# Altium schematic sheet PROC054D_AWR_Interfaces.SchDoc: AWR_1
size 558 x 431 mm; Date: Not shown in title block; ApprovedBy: Not shown in title block; CheckedBy: Not shown in title block; Author: Not shown in title block; CompanyName: Not shown in title block; DrawnBy: a0271760; Engineer: Not shown in title block; Organization: Not shown in title block; Address1: Not shown in title block; Address2: Not shown in title block; Address3: Not shown in title block; Address4: Not shown in title block; DocumentNumber: 10; Revision: Use project pAWRameter SCH_Rev; SheetNumber: 10; SheetTotal: 19; PageSetup: Record=PageOptions|CenterHorizontal=True|CenterVertical=True|PrintScale=1.00|XCorrection=1.00|YCorrection=1.00|PrintKind=0|BorderSize=5000000|LeftOffset=0|BottomOffset=0|Orientation=2|PaperLength=1000|PaperWidth=1000|Scale=100|PaperSource=15|PrintQuality=600|MediaType=1|DitherType=10|PaperKind=Letter|PrintScaleMode=1; CurrentTime: Not shown in title block; CurrentDate: Not shown in title block; Time: Not shown in title block; DocumentFullPathAndName: Not shown in title block; DocumentName: Not shown in title block; ModifiedDate: Not shown in title block; ImagePath: Not shown in title block
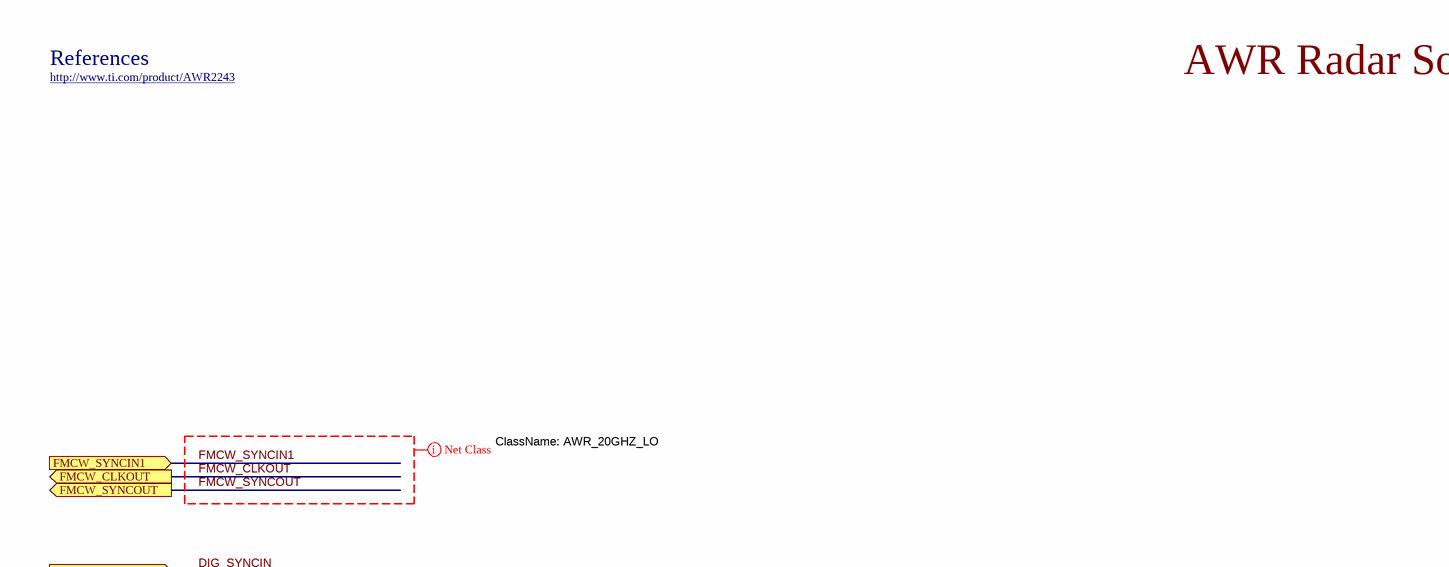
[diagram p0: PROC054D_AWR_Interfaces.SchDoc, top left]
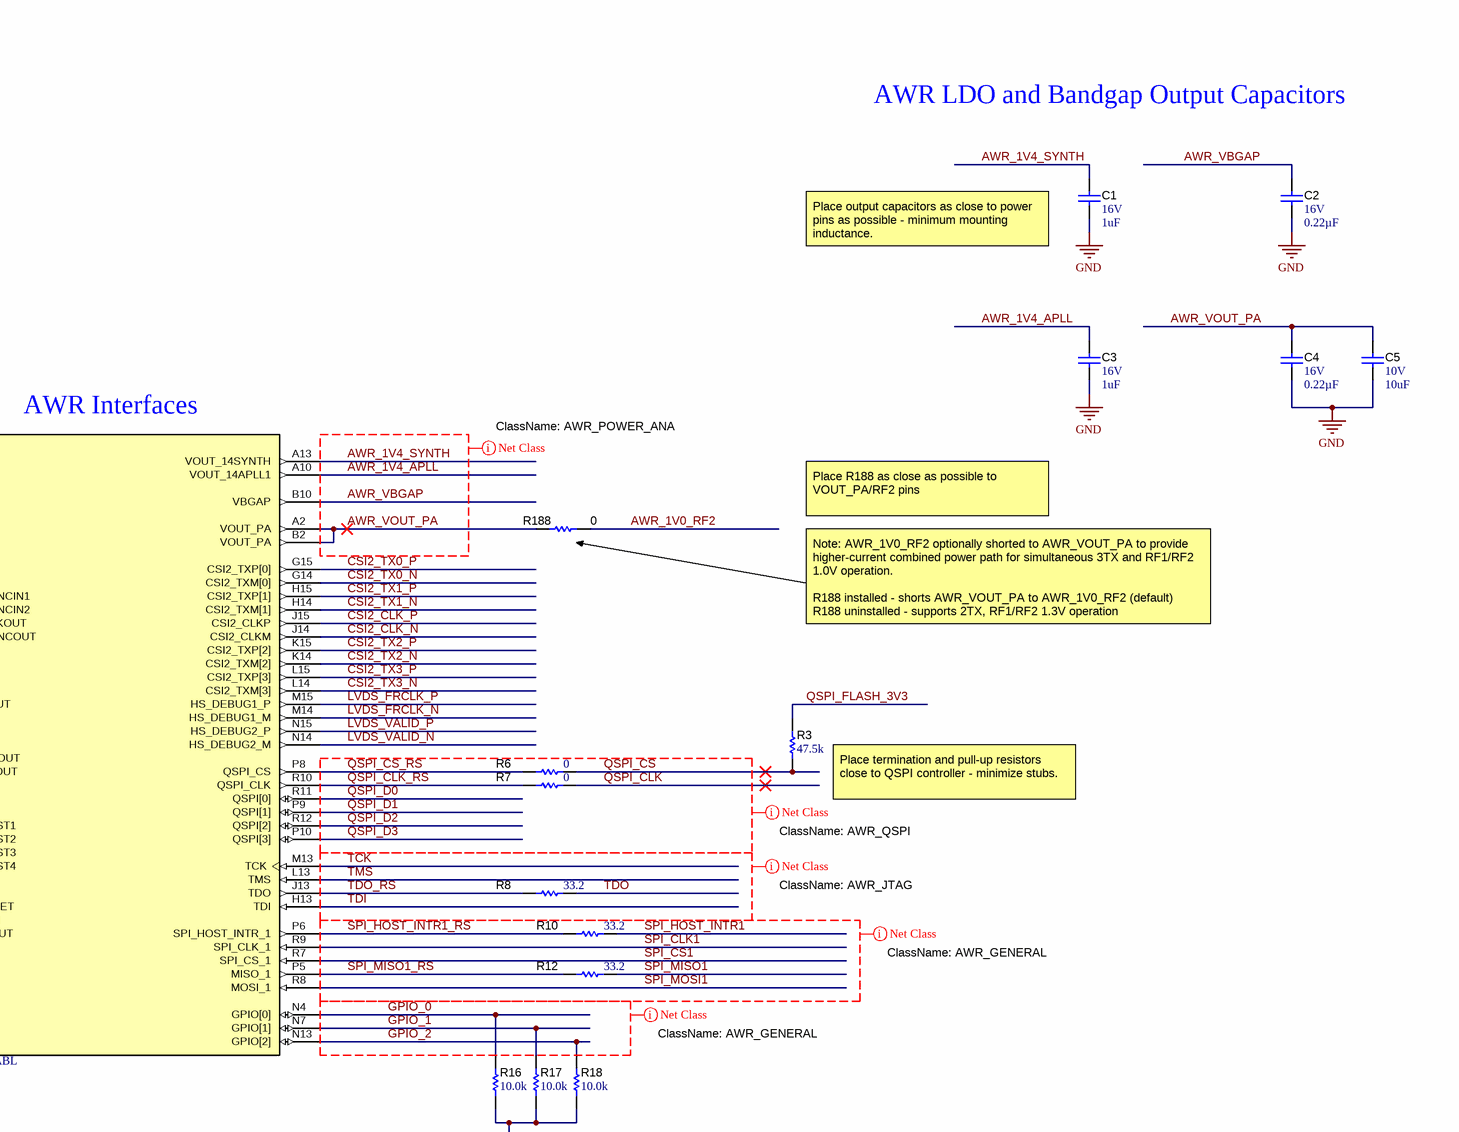
[diagram p1: PROC054D_AWR_Interfaces.SchDoc, top right]
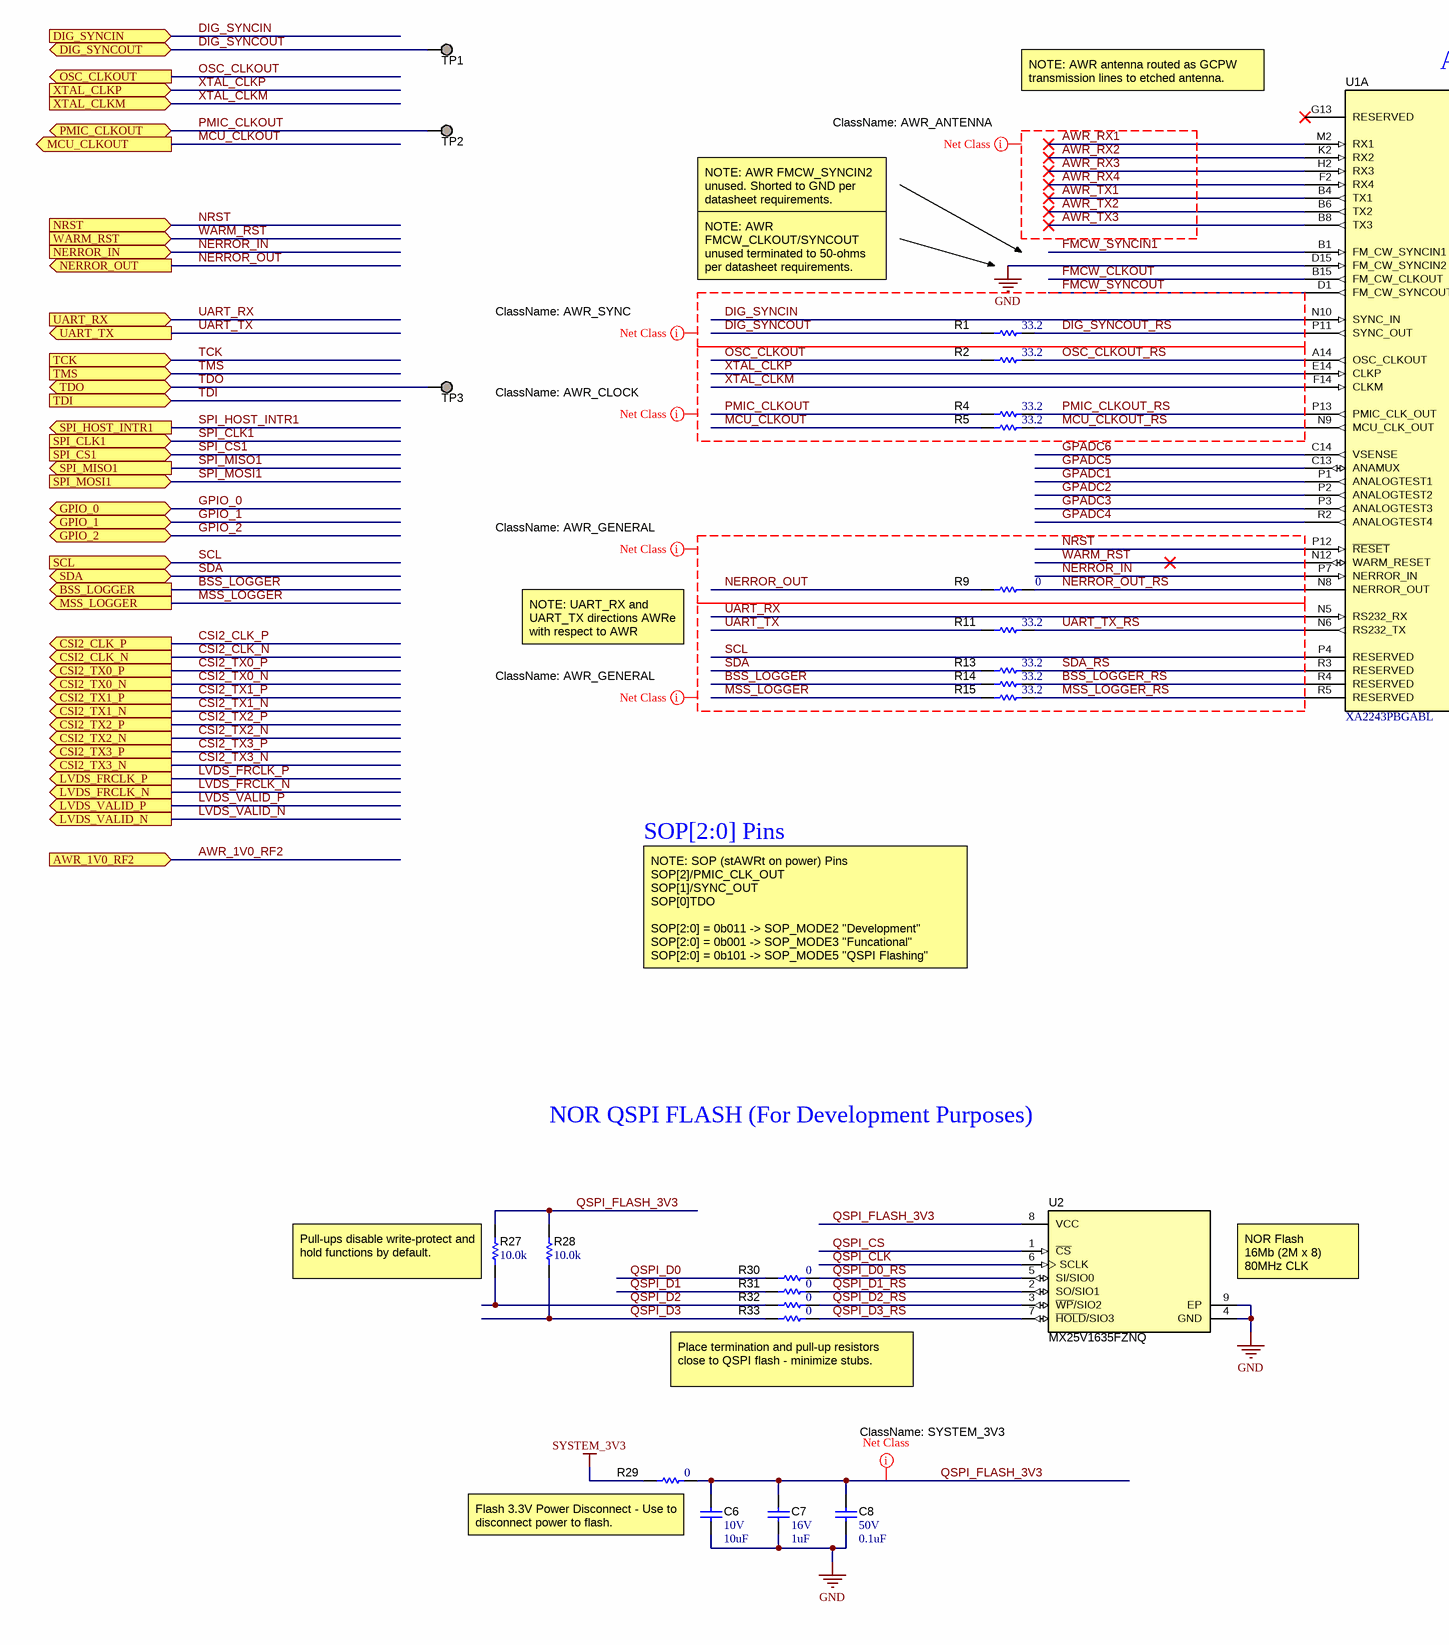
[diagram p2: PROC054D_AWR_Interfaces.SchDoc, bottom left]
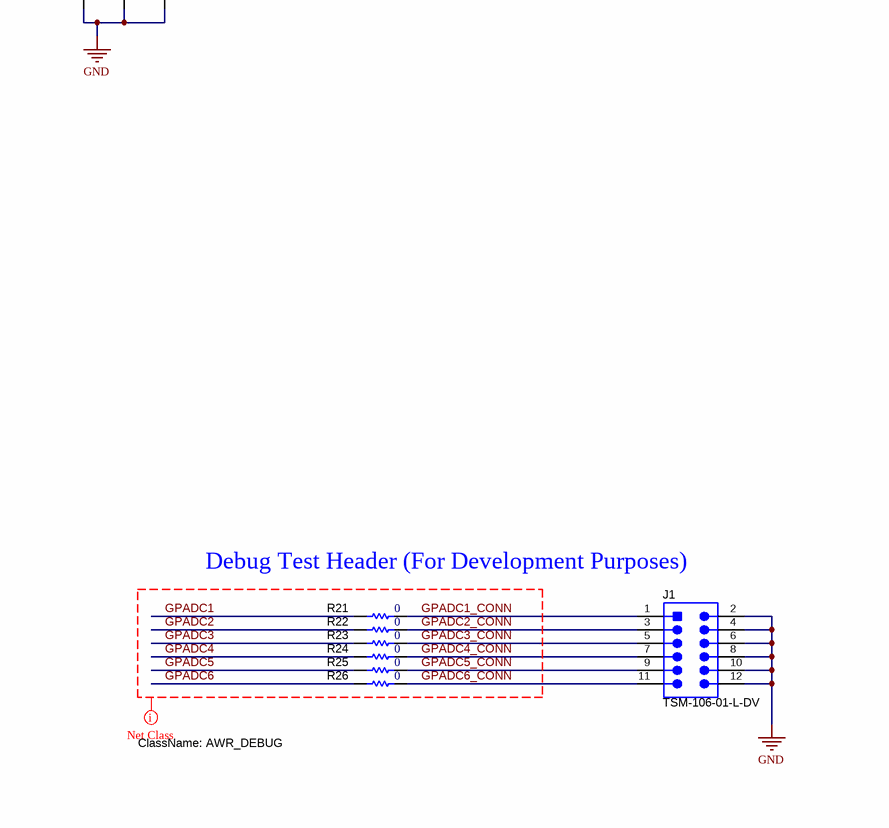
[diagram p3: PROC054D_AWR_Interfaces.SchDoc, bottom right]

## Parts
C1  VDC_V: 16V  ValueDisplayed: 1uF  [0603S]  (hidden comment: GCM188R71C105KA64D)
C2  VDC_V: 16V  ValueDisplayed: 0.22µF  [0402S]  (hidden comment: GCM155R71C224KE02D)
C3  VDC_V: 16V  ValueDisplayed: 1uF  [0603S]  (hidden comment: GCM188R71C105KA64D)
C4  VDC_V: 16V  ValueDisplayed: 0.22µF  [0402]  (hidden comment: GCM155R71C224KE02D)
C5  VDC_V: 10V  ValueDisplayed: 10uF  [0805]  (hidden comment: GCM21BR71A106KE22L)
C6  VDC_V: 10V  ValueDisplayed: 10uF  [0805L]  (hidden comment: GCM21BR71A106KE22L)
C7  VDC_V: 16V  ValueDisplayed: 1uF  [0603S]  (hidden comment: GCM188R71C105KA64D)
C8  VDC_V: 50V  ValueDisplayed: 0.1uF  [0402S]  (hidden comment: CGA2B3X7R1H104K050BB)
J1  TSM-106-01-L-DV  [Samtec_TSM-106-01-x-DV]
R1  ValueDisplayed: 33.2  [0402S]  (hidden comment: CRCW040233R2FKED)
R2  ValueDisplayed: 33.2  [0402S]  (hidden comment: CRCW040233R2FKED)
R3  ValueDisplayed: 47.5k  [0402]  (hidden comment: CRCW040247K5FKED)
R4  ValueDisplayed: 33.2  [0402S]  (hidden comment: CRCW040233R2FKED)
R5  ValueDisplayed: 33.2  [0402S]  (hidden comment: CRCW040233R2FKED)
R6  ValueDisplayed: 0  [0201]  (hidden comment: CRCW02010000Z0ED)
R7  ValueDisplayed: 0  [0201]  (hidden comment: CRCW02010000Z0ED)
R8  ValueDisplayed: 33.2  [0402S]  (hidden comment: CRCW040233R2FKED)
R9  ValueDisplayed: 0  [0402S]  (hidden comment: ERJ-2GE0R00X)
R10  ValueDisplayed: 33.2  [0402S]  (hidden comment: CRCW040233R2FKED)
R11  ValueDisplayed: 33.2  [0402S]  (hidden comment: CRCW040233R2FKED)
R12  ValueDisplayed: 33.2  [0402S]  (hidden comment: CRCW040233R2FKED)
R13  ValueDisplayed: 33.2  [0402S]  (hidden comment: CRCW040233R2FKED)
R14  ValueDisplayed: 33.2  [0402S]  (hidden comment: CRCW040233R2FKED)
R15  ValueDisplayed: 33.2  [0402S]  (hidden comment: CRCW040233R2FKED)
R16  ValueDisplayed: 10.0k  [0402]  (hidden comment: CRCW040210K0FKED)
R17  ValueDisplayed: 10.0k  [0402]  (hidden comment: CRCW040210K0FKED)
R18  ValueDisplayed: 10.0k  [0402]  (hidden comment: CRCW040210K0FKED)
R21  ValueDisplayed: 0  [0402]  (hidden comment: CRCW04020000Z0ED)
R22  ValueDisplayed: 0  [0402]  (hidden comment: CRCW04020000Z0ED)
R23  ValueDisplayed: 0  [0402]  (hidden comment: CRCW04020000Z0ED)
R24  ValueDisplayed: 0  [0402]  (hidden comment: CRCW04020000Z0ED)
R25  ValueDisplayed: 0  [0402]  (hidden comment: CRCW04020000Z0ED)
R26  ValueDisplayed: 0  [0402]  (hidden comment: CRCW04020000Z0ED)
R27  ValueDisplayed: 10.0k  [0402S]  (hidden comment: CRCW040210K0FKED)
R28  ValueDisplayed: 10.0k  [0402S]  (hidden comment: CRCW040210K0FKED)
R29  ValueDisplayed: 0  [0805_HV]  (hidden comment: CRCW08050000Z0EAHP)
R30  ValueDisplayed: 0  [0201]  (hidden comment: CRCW02010000Z0ED)
R31  ValueDisplayed: 0  [0201]  (hidden comment: CRCW02010000Z0ED)
R32  ValueDisplayed: 0  [0201]  (hidden comment: CRCW02010000Z0ED)
R33  ValueDisplayed: 0  [0201]  (hidden comment: CRCW02010000Z0ED)
R188  ValueDisplayed: 0  [0805L]  (hidden comment: PMR10EZPJ000)
TP1  TP_SM_1MM  [TP_SM_1MM]  (value not drawn)  (no BOM)
TP2  TP_SM_1MM  [TP_SM_1MM]  (value not drawn)  (no BOM)
TP3  TP_SM_1MM  [TP_SM_1MM]  (value not drawn)  (no BOM)
U1  XA2243PBGABL  [ABL0161A]  (part A of 2)
U2  MX25V1635FZNQ  [WSON-8L_6x5MM_EP]

## Ports
AWR_1V0_RF2 (in), BSS_LOGGER (out), CSI2_CLK_N (out), CSI2_CLK_P (out), CSI2_TX0_N (out), CSI2_TX0_P (out), CSI2_TX1_N (out), CSI2_TX1_P (out), CSI2_TX2_N (out), CSI2_TX2_P (out), CSI2_TX3_N (out), CSI2_TX3_P (out), DIG_SYNCIN (in), DIG_SYNCOUT (bidir), FMCW_CLKOUT (out), FMCW_SYNCIN1 (in), FMCW_SYNCOUT (out), GPIO_0 (bidir), GPIO_1 (bidir), GPIO_2 (bidir), LVDS_FRCLK_N (out), LVDS_FRCLK_P (out), LVDS_VALID_N (out), LVDS_VALID_P (out), MCU_CLKOUT (out), MSS_LOGGER (out), NERROR_IN (in), NERROR_OUT (out), NRST (in), OSC_CLKOUT (out), PMIC_CLKOUT (bidir), SCL (in), SDA (bidir), SPI_CLK1 (in), SPI_CS1 (in), SPI_HOST_INTR1 (out), SPI_MISO1 (out), SPI_MOSI1 (in), TCK (in), TDI (in), TDO (bidir), TMS (in), UART_RX (in), UART_TX (out), WARM_RST (in), XTAL_CLKM (in), XTAL_CLKP (in)

## Nets
GND: C1.2 C2.2 C3.2 C4.2 C5.2 C6.2 C7.2 C8.2 J1.2 J1.4 J1.6 J1.8 J1.10 J1.12 R16.1 R17.1 R18.1 U1.D15(FM_CW_SYNCIN2) U2.4(GND) U2.9(EP)
SYSTEM_3V3: R29.2
AWR_1V0_RF2: R188.2 ; port AWR_1V0_RF2
AWR_1V4_APLL: C3.1 U1.A10(VOUT_14APLL1)
AWR_1V4_SYNTH: C1.1 U1.A13(VOUT_14SYNTH)
AWR_RX1: U1.M2(RX1)
AWR_RX2: U1.K2(RX2)
AWR_RX3: U1.H2(RX3)
AWR_RX4: U1.F2(RX4)
AWR_TX1: U1.B4(TX1)
AWR_TX2: U1.B6(TX2)
AWR_TX3: U1.B8(TX3)
AWR_VBGAP: C2.1 U1.B10(VBGAP)
AWR_VOUT_PA: C4.1 C5.1 R188.1 U1.A2(VOUT_PA) U1.B2(VOUT_PA)
BSS_LOGGER: R14.1 ; port BSS_LOGGER
BSS_LOGGER_RS: R14.2 U1.R4(RESERVED)
CSI2_CLK_N: U1.J14(CSI2_CLKM) ; port CSI2_CLK_N
CSI2_CLK_P: U1.J15(CSI2_CLKP) ; port CSI2_CLK_P
CSI2_TX0_N: U1.G14(CSI2_TXM[0]) ; port CSI2_TX0_N
CSI2_TX0_P: U1.G15(CSI2_TXP[0]) ; port CSI2_TX0_P
CSI2_TX1_N: U1.H14(CSI2_TXM[1]) ; port CSI2_TX1_N
CSI2_TX1_P: U1.H15(CSI2_TXP[1]) ; port CSI2_TX1_P
CSI2_TX2_N: U1.K14(CSI2_TXM[2]) ; port CSI2_TX2_N
CSI2_TX2_P: U1.K15(CSI2_TXP[2]) ; port CSI2_TX2_P
CSI2_TX3_N: U1.L14(CSI2_TXM[3]) ; port CSI2_TX3_N
CSI2_TX3_P: U1.L15(CSI2_TXP[3]) ; port CSI2_TX3_P
DIG_SYNCIN: U1.N10(SYNC_IN) ; port DIG_SYNCIN
DIG_SYNCOUT: R1.1 TP1.1 ; port DIG_SYNCOUT
DIG_SYNCOUT_RS: R1.2 U1.P11(SYNC_OUT)
FMCW_CLKOUT: U1.B15(FM_CW_CLKOUT) ; port FMCW_CLKOUT
FMCW_SYNCIN1: U1.B1(FM_CW_SYNCIN1) ; port FMCW_SYNCIN1
FMCW_SYNCOUT: U1.D1(FM_CW_SYNCOUT) ; port FMCW_SYNCOUT
GPADC1: R21.1 U1.P1(ANALOGTEST1)
GPADC1_CONN: J1.1 R21.2
GPADC2: R22.1 U1.P2(ANALOGTEST2)
GPADC2_CONN: J1.3 R22.2
GPADC3: R23.1 U1.P3(ANALOGTEST3)
GPADC3_CONN: J1.5 R23.2
GPADC4: R24.1 U1.R2(ANALOGTEST4)
GPADC4_CONN: J1.7 R24.2
GPADC5: R25.1 U1.C13(ANAMUX)
GPADC5_CONN: J1.9 R25.2
GPADC6: R26.1 U1.C14(VSENSE)
GPADC6_CONN: J1.11 R26.2
GPIO_0: R16.2 U1.N4(GPIO[0]) ; port GPIO_0
GPIO_1: R17.2 U1.N7(GPIO[1]) ; port GPIO_1
GPIO_2: R18.2 U1.N13(GPIO[2]) ; port GPIO_2
LVDS_FRCLK_N: U1.M14(HS_DEBUG1_M) ; port LVDS_FRCLK_N
LVDS_FRCLK_P: U1.M15(HS_DEBUG1_P) ; port LVDS_FRCLK_P
LVDS_VALID_N: U1.N14(HS_DEBUG2_M) ; port LVDS_VALID_N
LVDS_VALID_P: U1.N15(HS_DEBUG2_P) ; port LVDS_VALID_P
MCU_CLKOUT: R5.1 ; port MCU_CLKOUT
MCU_CLKOUT_RS: R5.2 U1.N9(MCU_CLK_OUT)
MSS_LOGGER: R15.1 ; port MSS_LOGGER
MSS_LOGGER_RS: R15.2 U1.R5(RESERVED)
NERROR_IN: U1.P7(NERROR_IN) ; port NERROR_IN
NERROR_OUT: R9.1 ; port NERROR_OUT
NERROR_OUT_RS: R9.2 U1.N8(NERROR_OUT)
NRST: U1.P12(~{RESET}) ; port NRST
OSC_CLKOUT: R2.1 ; port OSC_CLKOUT
OSC_CLKOUT_RS: R2.2 U1.A14(OSC_CLKOUT)
PMIC_CLKOUT: R4.1 TP2.1 ; port PMIC_CLKOUT
PMIC_CLKOUT_RS: R4.2 U1.P13(PMIC_CLK_OUT)
QSPI_CLK: R7.2 U2.6(SCLK)
QSPI_CLK_RS: R7.1 U1.R10(QSPI_CLK)
QSPI_CS: R3.1 R6.2 U2.1(~{CS})
QSPI_CS_RS: R6.1 U1.P8(QSPI_CS)
QSPI_D0: R30.1 U1.R11(QSPI[0])
QSPI_D0_RS: R30.2 U2.5(SI/SIO0)
QSPI_D1: R31.1 U1.P9(QSPI[1])
QSPI_D1_RS: R31.2 U2.2(SO/SIO1)
QSPI_D2: R27.2 R32.1 U1.R12(QSPI[2])
QSPI_D2_RS: R32.2 U2.3(~{WP}/SIO2)
QSPI_D3: R28.2 R33.1 U1.P10(QSPI[3])
QSPI_D3_RS: R33.2 U2.7(~{HOLD}/SIO3)
QSPI_FLASH_3V3: C6.1 C7.1 C8.1 R3.2 R27.1 R28.1 R29.1 U2.8(VCC)
SCL: U1.P4(RESERVED) ; port SCL
SDA: R13.1 ; port SDA
SDA_RS: R13.2 U1.R3(RESERVED)
SPI_CLK1: U1.R9(SPI_CLK_1) ; port SPI_CLK1
SPI_CS1: U1.R7(SPI_CS_1) ; port SPI_CS1
SPI_HOST_INTR1: R10.2 ; port SPI_HOST_INTR1
SPI_HOST_INTR1_RS: R10.1 U1.P6(SPI_HOST_INTR_1)
SPI_MISO1: R12.2 ; port SPI_MISO1
SPI_MISO1_RS: R12.1 U1.P5(MISO_1)
SPI_MOSI1: U1.R8(MOSI_1) ; port SPI_MOSI1
TCK: U1.M13(TCK) ; port TCK
TDI: U1.H13(TDI) ; port TDI
TDO: R8.2 TP3.1 ; port TDO
TDO_RS: R8.1 U1.J13(TDO)
TMS: U1.L13(TMS) ; port TMS
UART_RX: U1.N5(RS232_RX) ; port UART_RX
UART_TX: R11.1 ; port UART_TX
UART_TX_RS: R11.2 U1.N6(RS232_TX)
WARM_RST: U1.N12(WARM_RESET) ; port WARM_RST
XTAL_CLKM: U1.F14(CLKM) ; port XTAL_CLKM
XTAL_CLKP: U1.E14(CLKP) ; port XTAL_CLKP

Not connected (* = marked no-connect by the designer): U1 G13(RESERVED)*

## Layout directives
net class AWR_DEBUG: GPADC1, GPADC1_CONN, GPADC2, GPADC2_CONN, GPADC3, GPADC3_CONN, GPADC4, GPADC4_CONN, GPADC5, GPADC5_CONN, GPADC6, GPADC6_CONN
net class AWR_QSPI: QSPI_CLK, QSPI_CLK_RS, QSPI_CS, QSPI_CS_RS, QSPI_D0, QSPI_D1, QSPI_D2, QSPI_D3
net class AWR_JTAG: TCK, TDI, TDO, TDO_RS, TMS
net class AWR_POWER_ANA: AWR_1V4_APLL, AWR_1V4_SYNTH, AWR_VBGAP, AWR_VOUT_PA
net class AWR_ANTENNA: AWR_RX1, AWR_RX2, AWR_RX3, AWR_RX4, AWR_TX1, AWR_TX2, AWR_TX3
net class SYSTEM_3V3: QSPI_FLASH_3V3
net class AWR_20GHZ_LO: FMCW_CLKOUT, FMCW_SYNCIN1, FMCW_SYNCOUT
net class AWR_GENERAL: BSS_LOGGER, BSS_LOGGER_RS, GPIO_0, GPIO_1, GPIO_2, MSS_LOGGER, MSS_LOGGER_RS, NERROR_IN, NERROR_OUT, NERROR_OUT_RS, NRST, SCL, SDA, SDA_RS, SPI_CLK1, SPI_CS1, SPI_HOST_INTR1, SPI_HOST_INTR1_RS, SPI_MISO1, SPI_MISO1_RS, SPI_MOSI1, UART_RX, UART_TX, UART_TX_RS, WARM_RST
net class AWR_CLOCK: MCU_CLKOUT, MCU_CLKOUT_RS, OSC_CLKOUT, OSC_CLKOUT_RS, PMIC_CLKOUT, PMIC_CLKOUT_RS, XTAL_CLKM, XTAL_CLKP
net class AWR_SYNC: DIG_SYNCIN, DIG_SYNCOUT, DIG_SYNCOUT_RS, FMCW_SYNCOUT

## Notes on the sheet
- References
- http://www.ti.com/product/AWR2243
- AWR Radar SoC - Interfaces
- AWR LDO and Bandgap Output Capacitors
- (near C1) Place output capacitors as close to power pins as possible - minimum mounting inductance.
- NOTE: AWR antenna routed as GCPW transmission lines to etched antenna.
- (near U1) AWR Interfaces
- NOTE: AWR FMCW_SYNCIN2 unused. Shorted to GND per datasheet requirements.
- Place R188 as close as possible to VOUT_PA/RF2 pins
- NOTE: AWR FMCW_CLKOUT/SYNCOUT unused terminated to 50-ohms per datasheet requirements.
- Note: AWR_1V0_RF2 optionally shorted to AWR_VOUT_PA to provide higher-current combined power path for simultaneous 3TX and RF1/RF2 1.0V operation.
  R188 installed - shorts AWR_VOUT_PA to AWR_1V0_RF2 (default)
  R188 uninstalled - supports 2TX, RF1/RF2 1.3V operation
- (near R3) Place termination and pull-up resistors close to QSPI controller - minimize stubs.
- NOTE: UART_RX and UART_TX directions AWRe with respect to AWR
- SOP[2:0] Pins
- NOTE: SOP (stAWRt on power) Pins SOP[2]/PMIC_CLK_OUT
  SOP[1]/SYNC_OUT
  SOP[0]TDO
  SOP[2:0] = 0b011 -> SOP_MODE2 "Development"
  SOP[2:0]	= 0b001 -> SOP_MODE3 "Funcational"
  SOP[2:0]	= 0b101 -> SOP_MODE5 "QSPI Flashing"
- NOR QSPI FLASH (For Development Purposes)
- (near R27) Pull-ups disable write-protect and hold functions by default.
- (near U2) NOR Flash
  16Mb (2M x 8)
  80MHz CLK
- Debug Test Header (For Development Purposes)
- (near R33) Place termination and pull-up resistors close to QSPI flash - minimize stubs.
- (near R29) Flash 3.3V Power Disconnect - Use to disconnect power to flash.
- Drawn By:
- SVN Rev:
- Number:
- TID #:
- Orderable:
- Rev:
- Sheet Title:
- File:
- Project Title:
- Designed for:
- Assembly VAWRiant:
- Mod. Date:
- Sheet:
- Size:
- of
- C
- http://www.ti.com
- Texas Instruments and/or its licensors do not wAWRrant the accuracy or completeness of this specification or any information contained therein. Texas Instruments and/or its licensors do not wAWRrant that this design will meet the specifications, will be suitable for your application or fit for any pAWRticulAWR purpose, or will operate in an implementation. Texas Instruments and/or its licensors do not wAWRrant that the design is production worthy. You should completely validate and test your design implementation to confirm the system functionality for your application.
- Engineer:
- Contact:
- © Texas Instruments

## Library data of the parts
C1 C7 = CMP-0007136-5: CAP, CERM, 1 uF, 16 V, +/- 10%, X7R, AEC-Q200 Grade 1, 0603; Manufacturer: MuRata; TaMin_C: -55°C; Polarized: N; SizeAreaWB_mm2: 4.68; Value1: Unknown; U/M: EA; Value: 1uF; TaMax_C: 125°C; SizeZ_mm: 1; SizeX_mm: 1.6; SizeY_mm: 0.8; Cap_Case: 0603; SizeArea_mm2: 1.28; CompType: Capacitor; AEC Qualified: Y; Cap_F: 1µF; AEC Category: Q200; Supplier Part Number 2: 81-GCM188R71C105K64D; Publisher: Texas Instruments; Supplier 2: Mouser; TempCo: X7R; Published: 2008-06-19; RoHS: Y; MountType: SMT; Supplier 1: Digi-Key; PackageReference: 0603; Tolerance_%: 10%; Value2: 16V; LatestRevisionDate: 2017-03-09; PartNumber: GCM188R71C105KA64D; ComponentLink1Description: Datasheet link; AEC Grade: 1; Supplier Part Number 1: 490-5241-6-ND; Technology: Ceramic; ComponentLink1URL: http://psearch.en.murata.com/capacitor/product/GCM188R71C105KA64%23.pdf
C2 = CMP-0078265-1: CAP, CERM, 0.22 µF, 16 V,+/- 10%, X7R, AEC-Q200 Grade 1, 0402; Manufacturer: MuRata; TaMin_C: -55°C; Polarized: N; SizeAreaWB_mm2: 3; U/M: EA; Value: 0.22uF; TaMax_C: 125°C; SizeZ_mm: 0.6; SizeX_mm: 1; SizeY_mm: 0.5; Cap_Case: 0402; CompType: Capacitor; AEC Qualified: Y; Cap_F: 220nF; AEC Category: Q200; ComponentLink1URL: http://psearch.en.murata.com/capacitor/product/GCM155R71C224KE02%23.pdf; Supplier Part Number 2: 81-GCM155R71C224KE2D; Supplier 2: Mouser; TempCo: X7R; RoHS: Y; MountType: SMT; Supplier 1: Digi-Key; PackageReference: 0402; Tolerance_%: 10%; Value2: 16V; SizeArea_mm2: 0.5; PartNumber: GCM155R71C224KE02D; ComponentLink1Description: Datasheet link; AEC Grade: 1; Supplier Part Number 1: 490-10671-1-ND; Technology: Ceramic
C3 = CMP-0007136-5: CAP, CERM, 1 uF, 16 V, +/- 10%, X7R, AEC-Q200 Grade 1, 0603; Manufacturer: MuRata; TaMin_C: -55°C; Polarized: N; SizeAreaWB_mm2: 4.68; Value1: Unknown; U/M: EA; Value: 1uF; TaMax_C: 125°C; SizeZ_mm: 1; SizeX_mm: 1.6; SizeY_mm: 0.8; Cap_Case: 0603; SizeArea_mm2: 1.28; AEC Qualified: Y; Cap_F: 1µF; AEC Category: Q200; Supplier Part Number 2: 81-GCM188R71C105K64D; Publisher: Texas Instruments; Supplier 2: Mouser; TempCo: X7R; Published: 2008-06-19; RoHS: Y; MountType: SMT; Supplier 1: Digi-Key; PackageReference: 0603; Tolerance_%: 10%; Value2: 16V; CompType: Capacitor; LatestRevisionDate: 2017-03-09; PartNumber: GCM188R71C105KA64D; ComponentLink1Description: Datasheet link; AEC Grade: 1; Supplier Part Number 1: 490-5241-6-ND; Technology: Ceramic; ComponentLink1URL: http://psearch.en.murata.com/capacitor/product/GCM188R71C105KA64%23.pdf
C4 = CMP-0078265-1: CAP, CERM, 0.22 µF, 16 V,+/- 10%, X7R, AEC-Q200 Grade 1, 0402; Manufacturer: MuRata; TaMin_C: -55°C; Polarized: N; SizeAreaWB_mm2: 3; U/M: EA; Value: 0.22uF; TaMax_C: 125°C; SizeZ_mm: 0.6; SizeX_mm: 1; SizeY_mm: 0.5; CompType: Capacitor; AEC Qualified: Y; Cap_F: 220nF; AEC Category: Q200; ComponentLink1URL: http://psearch.en.murata.com/capacitor/product/GCM155R71C224KE02%23.pdf; Supplier Part Number 2: 81-GCM155R71C224KE2D; Supplier 2: Mouser; TempCo: X7R; RoHS: Y; MountType: SMT; Supplier 1: Digi-Key; PackageReference: 0402; Tolerance_%: 10%; Cap_Case: 0402; Value2: 16V; SizeArea_mm2: 0.5; PartNumber: GCM155R71C224KE02D; ComponentLink1Description: Datasheet link; AEC Grade: 1; Supplier Part Number 1: 490-10671-1-ND; Technology: Ceramic
C5 = CMP-0008017-2: CAP, CERM, 10 uF, 10 V, +/- 10%, X7R, 0805; Manufacturer: MuRata; TaMin_C: -55°C; Polarized: N; SizeAreaWB_mm2: 6.75; Value1: Unknown; U/M: EA; Value: 10uF; TaMax_C: 125°C; SizeZ_mm: 1.45; SizeX_mm: 2; SizeY_mm: 1.25; SizeArea_mm2: 2.5; Cap_F: 10µF; AEC Category: Q200; Supplier Part Number 2: 06AC6014; Publisher: Texas Instruments; Supplier 2: Newark; Supplier Part Number 3: 81-GCM21BR71A106KE2L; TempCo: X7R; Supplier 3: Mouser; Published: 2008-06-19; RoHS: Y; MountType: SMT; Supplier 1: Digi-Key; PackageReference: 0805; Tolerance_%: 10%; Cap_Case: 0805; Value2: 10V; CompType: Capacitor; LatestRevisionDate: 2017-03-09; PartNumber: GCM21BR71A106KE22L; AEC Qualified: ?; ComponentLink1Description: Datasheet link; Supplier Part Number 1: 490-10674-1-ND; Technology: Ceramic; ComponentLink1URL: http://www.murata.com/products/catalog/pdf/c03e.pdf
C6 = CMP-0008017-2: CAP, CERM, 10 uF, 10 V, +/- 10%, X7R, 0805; Manufacturer: MuRata; TaMin_C: -55°C; Polarized: N; SizeAreaWB_mm2: 6.75; Value1: Unknown; U/M: EA; Value: 10uF; TaMax_C: 125°C; SizeZ_mm: 1.45; SizeX_mm: 2; SizeY_mm: 1.25; Cap_Case: 0805; SizeArea_mm2: 2.5; CompType: Capacitor; Cap_F: 10µF; AEC Category: Q200; Supplier Part Number 2: 06AC6014; Publisher: Texas Instruments; Supplier 2: Newark; Supplier Part Number 3: 81-GCM21BR71A106KE2L; TempCo: X7R; Supplier 3: Mouser; Published: 2008-06-19; RoHS: Y; MountType: SMT; Supplier 1: Digi-Key; PackageReference: 0805; Tolerance_%: 10%; Value2: 10V; LatestRevisionDate: 2017-03-09; PartNumber: GCM21BR71A106KE22L; AEC Qualified: ?; ComponentLink1Description: Datasheet link; Supplier Part Number 1: 490-10674-1-ND; Technology: Ceramic; ComponentLink1URL: http://www.murata.com/products/catalog/pdf/c03e.pdf
C8 = CMP-0006325-2: CAP, CERM, 0.1 uF, 50 V, +/- 10%, X7R, AEC-Q200 Grade 1, 0402; Manufacturer: TDK; TaMin_C: -55°C; ESR_ohm: 0.039064; Polarized: N; SizeAreaWB_mm2: 3; Value1: 0.039064 ohm; U/M: EA; Value: 0.1uF; TaMax_C: 125°C; SizeZ_mm: 0.6; SizeX_mm: 1; SizeY_mm: 0.5; Cap_Case: 0402; AEC Qualified: Y; Cap_F: 100nF; IRMS_A: 8.14669dA; AEC Category: Q200; Supplier Part Number 2: 04X3148; Publisher: Texas Instruments; Supplier 2: Newark; Supplier Part Number 3: 810-CGA2B3X7R1H104K; TempCo: X7R; Supplier 3: Mouser; Published: 2008-06-19; RoHS: Y; MountType: SMT; Supplier 1: Digi-Key; PackageReference: 0402; Tolerance_%: 10%; Value2: 50V; SizeArea_mm2: 0.5; CompType: Capacitor; LatestRevisionDate: 2017-03-09; PartNumber: CGA2B3X7R1H104K050BB; ComponentLink1Description: Datasheet link; AEC Grade: 1; Supplier Part Number 1: 445-6899-1-ND; Technology: Ceramic; ComponentLink1URL: https://product.tdk.com/en/search/capacitor/ceramic/mlcc/info?part_no=CGA2B3X7R1H104K050BB
J1 = CMP-0075594-2: Header, 2.54mm, 6x2, Gold, SMT; Manufacturer: Samtec; Pitch_mm: 2.54; Gender: Male; Cert_CSA: Y; Green_REACh: Passed; Current_A: 4.9A; Voltage_V: 475V; Shrouded: N; Green_Lifecycle: Active; Row_Count: 2; ComponentLink1Description: Datasheet URL; RoHS: Y; Supplier Part Number 3: 1803911; Supplier 1: Digi-Key; Cert_UL: Y; Orientation: Vertical; Green_EU RoHS: Passed; PackageReference: Header, 2.54mm, 6x2, SMT; Color: Black; PartNumber: TSM-106-01-L-DV; PinCount: 12; Supplier Part Number 2: 77P8295; ContactFinish: Gold; Supplier 2: Newark; ClassName: Header; RowSpacing_mm: 2.54; ComponentLink1URL: https://www.samtec.com/ftppub/cpdf/TSM-1XX-XX-XXX-XX-X-XXX-X-MKT.pdf; CompType: Header; MountType: SMT; Supplier Part Number 1: TSM-106-01-L-DV-ND; Supplier 3: Farnell; Green_EU RoHS-2: Passed
R1 R2 R4 R5 R8 R10-R13 = CMP-0026299-2: RES, 33.2, 1%, 0.063 W, AEC-Q200 Grade 0, 0402; Manufacturer: Vishay-Dale; Power_W: 63mW; TempCo: 100 ppm/C; Value_Code: 33R2; Value: 33.2; EIA_Code: E96; SizeX_mm: 1; SizeY_mm: 0.5; SizeZ_mm: 0.6; Value2: 0.063W; CompType: Resistor; AEC Qualified: Y; VDC_V: 50V; AEC Category: Q200; AEC Grade: 0; ComponentLink1URL: http://www.vishay.com/docs/20035/dcrcwe3.pdf; Supplier Part Number 2: 52K6980; Supplier 2: Newark; Supplier Part Number 3: 71-CRCW0402-33.2-E3; Supplier 3: Mouser; RoHS: E; Value1: 1%; MountType: SMT; Supplier 1: Digi-Key; PackageReference: 0402; Tolerance_%: 1%; Res_ohm: 33.2; SizeArea_mm2: 0.5; PartNumber: CRCW040233R2FKED; ComponentLink1Description: Datasheet link; Supplier Part Number 1: 541-33.2LCT-ND; Technology: Thick Film
R3 = CMP-0026395-2: RES, 47.5 k, 1%, 0.063 W, AEC-Q200 Grade 0, 0402; Manufacturer: Vishay-Dale; Power_W: 63mW; TempCo: 100 ppm/C; Value_Code: 47k5; Value: 47.5k; EIA_Code: E96; SizeX_mm: 1; SizeY_mm: 0.5; SizeZ_mm: 0.6; Value2: 0.063W; AEC Qualified: Y; VDC_V: 50V; AEC Category: Q200; AEC Grade: 0; ComponentLink1URL: http://www.vishay.com/docs/20035/dcrcwe3.pdf; Supplier Part Number 2: 52K7100; Supplier 2: Newark; Supplier Part Number 3: 71-CRCW0402-47.5K-E3; Supplier 3: Mouser; RoHS: E; Value1: 1%; MountType: SMT; Supplier 1: Digi-Key; PackageReference: 0402; Tolerance_%: 1%; Res_ohm: 47.5k; SizeArea_mm2: 0.5; CompType: Resistor; PartNumber: CRCW040247K5FKED; ComponentLink1Description: Datasheet link; Supplier Part Number 1: 541-47.5KLCT-ND; Technology: Thick Film
R6 R7 R30-R33 = CMP-0027008-4: RES, 0, 5%, 0.05 W, 0201; Manufacturer: Vishay-Dale; Power_W: 50mW; TempCo: ppm/C; Value_Code: 0000; Value: 0; EIA_Code: E24; SizeX_mm: 0.6; SizeY_mm: 0.3; SizeZ_mm: 0.26; Value2: 0.05W; SizeArea_mm2: 0.18; CompType: Resistor; AEC Qualified: N; AEC Category: Q200; RoHS: E; Value1: 5%; MountType: SMT; Supplier 1: Newark; PackageReference: 0201; Tolerance_%: 5%; Res_ohm: 0; PartNumber: CRCW02010000Z0ED; ComponentLink1Description: Datasheet link; AEC Grade: N/A; Supplier Part Number 1: 72M6743; Technology: Thick Film; ComponentLink1URL: http://www.vishay.com/docs/20052/crcw0201e3.pdf
R9 = CMP-0026992-3: RES, 0, 5%, 0.1 W, AEC-Q200 Grade 0, 0402; Manufacturer: Panasonic; Power_W: 100mW; TempCo: 600 ppm/C; Value_Code: 0000; Value: 0; EIA_Code: E24; SizeX_mm: 1; SizeY_mm: 0.5; SizeZ_mm: 0.6; Value2: 0.1W; CompType: Resistor; AEC Qualified: Y; VDC_V: 50V; AEC Category: Q200; SizeAreaWB_mm2: 3; Supplier Part Number 2: 65T8307; Supplier 2: Newark; Supplier Part Number 3: 667-ERJ-2GE0R00X; Supplier 3: Mouser; RoHS: Y; Value1: 5%; MountType: SMT; Supplier 1: Digi-Key; PackageReference: 0402; Tolerance_%: 5%; Res_ohm: 0; SizeArea_mm2: 0.5; PartNumber: ERJ-2GE0R00X; ComponentLink1Description: Datasheet link; Supplier Part Number 1: P0.0JCT-ND; Technology: Thick Film; ComponentLink1URL: https://industrial.panasonic.com/cdbs/www-data/pdf/RDA0000/AOA0000C301.pdf; AEC Grade: 0
R14 R15 = CMP-0026299-2: RES, 33.2, 1%, 0.063 W, AEC-Q200 Grade 0, 0402; Manufacturer: Vishay-Dale; Power_W: 63mW; TempCo: 100 ppm/C; Value_Code: 33R2; Value: 33.2; EIA_Code: E96; SizeX_mm: 1; SizeY_mm: 0.5; SizeZ_mm: 0.6; Value2: 0.063W; AEC Qualified: Y; VDC_V: 50V; AEC Category: Q200; AEC Grade: 0; ComponentLink1URL: http://www.vishay.com/docs/20035/dcrcwe3.pdf; Supplier Part Number 2: 52K6980; Supplier 2: Newark; Supplier Part Number 3: 71-CRCW0402-33.2-E3; Supplier 3: Mouser; RoHS: E; Value1: 1%; MountType: SMT; Supplier 1: Digi-Key; PackageReference: 0402; Tolerance_%: 1%; Res_ohm: 33.2; SizeArea_mm2: 0.5; CompType: Resistor; PartNumber: CRCW040233R2FKED; ComponentLink1Description: Datasheet link; Supplier Part Number 1: 541-33.2LCT-ND; Technology: Thick Film
R16 R27 R28 = CMP-0025958-3: RES, 10.0 k, 1%, 0.063 W, AEC-Q200 Grade 0, 0402; Manufacturer: Vishay-Dale; Power_W: 63mW; TempCo: 100 ppm/C; Value_Code: 10k0; Value: 10.0k; EIA_Code: E96; Res_ohm: 10k; SizeX_mm: 1; SizeY_mm: 0.5; SizeZ_mm: 0.6; Value2: 0.063W; CompType: Resistor; AEC Qualified: Y; VDC_V: 50V; AEC Category: Q200; AEC Grade: 0; Supplier Part Number 2: 52K6595; Supplier 2: Newark; Supplier Part Number 3: 71-CRCW0402-10K-E3; Supplier 3: Mouser; RoHS: E; Value1: 1%; MountType: SMT; Supplier 1: Digi-Key; PackageReference: 0402; Tolerance_%: 1%; SizeArea_mm2: 0.5; PartNumber: CRCW040210K0FKED; ComponentLink1Description: Datasheet link; Supplier Part Number 1: 541-10.0KLCT-ND; Technology: Thick Film; ComponentLink1URL: http://www.vishay.com/docs/20035/dcrcwe3.pdf
R17 R18 = CMP-0025958-3: RES, 10.0 k, 1%, 0.063 W, AEC-Q200 Grade 0, 0402; Manufacturer: Vishay-Dale; Power_W: 63mW; TempCo: 100 ppm/C; Value_Code: 10k0; Value: 10.0k; EIA_Code: E96; Res_ohm: 10k; SizeX_mm: 1; SizeY_mm: 0.5; SizeZ_mm: 0.6; Value2: 0.063W; AEC Qualified: Y; VDC_V: 50V; AEC Category: Q200; AEC Grade: 0; Supplier Part Number 2: 52K6595; Supplier 2: Newark; Supplier Part Number 3: 71-CRCW0402-10K-E3; Supplier 3: Mouser; RoHS: E; Value1: 1%; MountType: SMT; Supplier 1: Digi-Key; PackageReference: 0402; Tolerance_%: 1%; SizeArea_mm2: 0.5; CompType: Resistor; PartNumber: CRCW040210K0FKED; ComponentLink1Description: Datasheet link; Supplier Part Number 1: 541-10.0KLCT-ND; Technology: Thick Film; ComponentLink1URL: http://www.vishay.com/docs/20035/dcrcwe3.pdf
R21-R26 = CMP-0026822-3: RES, 0, 5%, 0.063 W, AEC-Q200 Grade 0, 0402; Manufacturer: Vishay-Dale; Power_W: 63mW; TempCo: 200 ppm/C; Value_Code: 0000; Value: 0; EIA_Code: E24; SizeX_mm: 1; SizeY_mm: 0.5; SizeZ_mm: 0.6; Value2: 0.063W; CompType: Resistor; AEC Qualified: Y; VDC_V: 50V; AEC Category: Q200; Supplier Part Number 2: 52K6543; Supplier 2: Newark; Supplier Part Number 3: 71-CRCW0402-0-E3; Supplier 3: Mouser; RoHS: E; Value1: 5%; MountType: SMT; Supplier 1: Digi-Key; PackageReference: 0402; Tolerance_%: 5%; Res_ohm: 0; SizeArea_mm2: 0.5; PartNumber: CRCW04020000Z0ED; ComponentLink1Description: Datasheet link; Supplier Part Number 1: 541-0.0JCT-ND; Technology: Thick Film; ComponentLink1URL: http://www.vishay.com/docs/20035/dcrcwe3.pdf; AEC Grade: 0
R29 = CMP-0020443-3: RES, 0, 5%, 0.333 W, AEC-Q200 Grade 0, 0805; Manufacturer: Vishay-Dale; Power_W: 333mW; TempCo: 200 ppm/C; Value_Code: 0000; Value: 0; EIA_Code: E24; SizeX_mm: 2; SizeY_mm: 1.25; SizeZ_mm: 1.45; Value2: 0.333W; SizeArea_mm2: 2.5; AEC Qualified: Y; AEC Category: Q200; VDC_V: 150V; Supplier Part Number 2: 68R2993; Supplier 2: Newark; Supplier Part Number 3: 71-CRCW08050000Z0EAH; Supplier 3: Mouser; RoHS: E; Value1: 5%; MountType: SMT; Supplier 1: Digi-Key; PackageReference: 0805; Tolerance_%: 5%; Res_ohm: 0; CompType: Resistor; PartNumber: CRCW08050000Z0EAHP; ComponentLink1Description: Datasheet link; Supplier Part Number 1: 541-0.0TBCT-ND; Technology: Thick Film; ComponentLink1URL: http://www.vishay.com/docs/20043/crcwhpe3.pdf; AEC Grade: 0
R188 = CMP-0081857-1: RES, 0, 0%,  W, AEC-Q200 Grade 0, 0805; Manufacturer: Rohm; SizeAreaWB_mm2: 6.75; SizeArea_mm2: 2.5; AEC Qualified: Y; AEC Category: Q200; Value: 0; SizeZ_mm: 1.45; SizeY_mm: 1.25; CompType: Resistor; SizeX_mm: 2; ComponentLink1Description: Datasheet link; RoHS: Y; Tolerance_%: 0%; Value_Code: 0; Supplier 1: Mouser; PackageReference: 0805; Technology: Thick Film; Res_ohm: 0; PartNumber: PMR10EZPJ000; AEC Grade: 0; Value2: W; ComponentLink1URL: http://www.rohm.com/web/global/datasheet/PMR10EZPJ000/pmr-jpw-e; Value1: 0%; MountType: SMT; Supplier Part Number 1: 755-PMR10EZPJ000
TP1-TP3 = CMP-0003825-1: 1mm Test Point, SMT; Manufacturer: Any; CompType: Test Point; PackageReference: 1mm Test Point, SMT; Publisher: Texas Instruments; LatestRevisionDate: 2017-03-09; ComponentLink1Description: Datasheet Link; ComponentLink1URL: https://sps06.itg.ti.com/sites/KMS/crossdivteams/altium/docs/ComponentDatasheets/PROBE_TEST_POINT.png; Key: TP_SM_1MM; MountType: SMT; PartNumber: TP_SM_1MM
U1 = CMP-0082537-1: Single Chip 77 and 79 GHz FMCW Transceiver, ABL0161A (FCBGA-161); Alternate Manufacturer: Texas Instruments; SizeAreaWB_mm2: 153.76; Rating: Automotive; SizeZ_mm: 1.17; SizeX_mm: 10.4; SizeArea_mm2: 108.16; CompType: IC; AEC Qualified: Y; AEC Category: Q200; ComponentLink1URL: http://www.ti.com/lit/ds/symlink/awr2243-q1.pdf; PackageDescription: FCBGA-161; MountType: SMT; ComponentLink2URL: http://www.ti.com/product/awr2243-q1; ComponentLink3Description: Online Datasheet; ComponentLink2Description: Product Folder; Manufacturer: Texas Instruments; ComponentLink3URL: http://www.ti.com/product/awr2243-q1/datasheet; PackageReference: ABL0161A; SizeY_mm: 10.4; PartNumber: XA2243PBGABL; ComponentLink1Description: Datasheet Link; PartId: 1
U2 = CMP-0079267-1: 2.3V-3.6V, 16M-BIT [x 1/x 2/x 4] CMOS FLASH Memory, WSON-8; Manufacturer: Macronix International Co., LTD; SizeArea_mm2: 30; SizeAreaWB_mm2: 56; SizeY_mm: 5; SizeZ_mm: 0.8; SizeX_mm: 6; PartNumber: MX25V1635FZNQ; PackageReference: WSON-8; Supplier Part Number 1: 1092-1211-ND; ComponentLink1Description: Datasheet URL; MountType: SMT; ComponentLink1URL: http://www.macronix.com/Lists/Datasheet/Attachments/6724/MX25V1635F,%202.5V,%2016Mb,%20v1.4.pdf; Supplier 1: Digi-Key; RoHS: Y